# Altium project IPC17学习板.PrjPcb
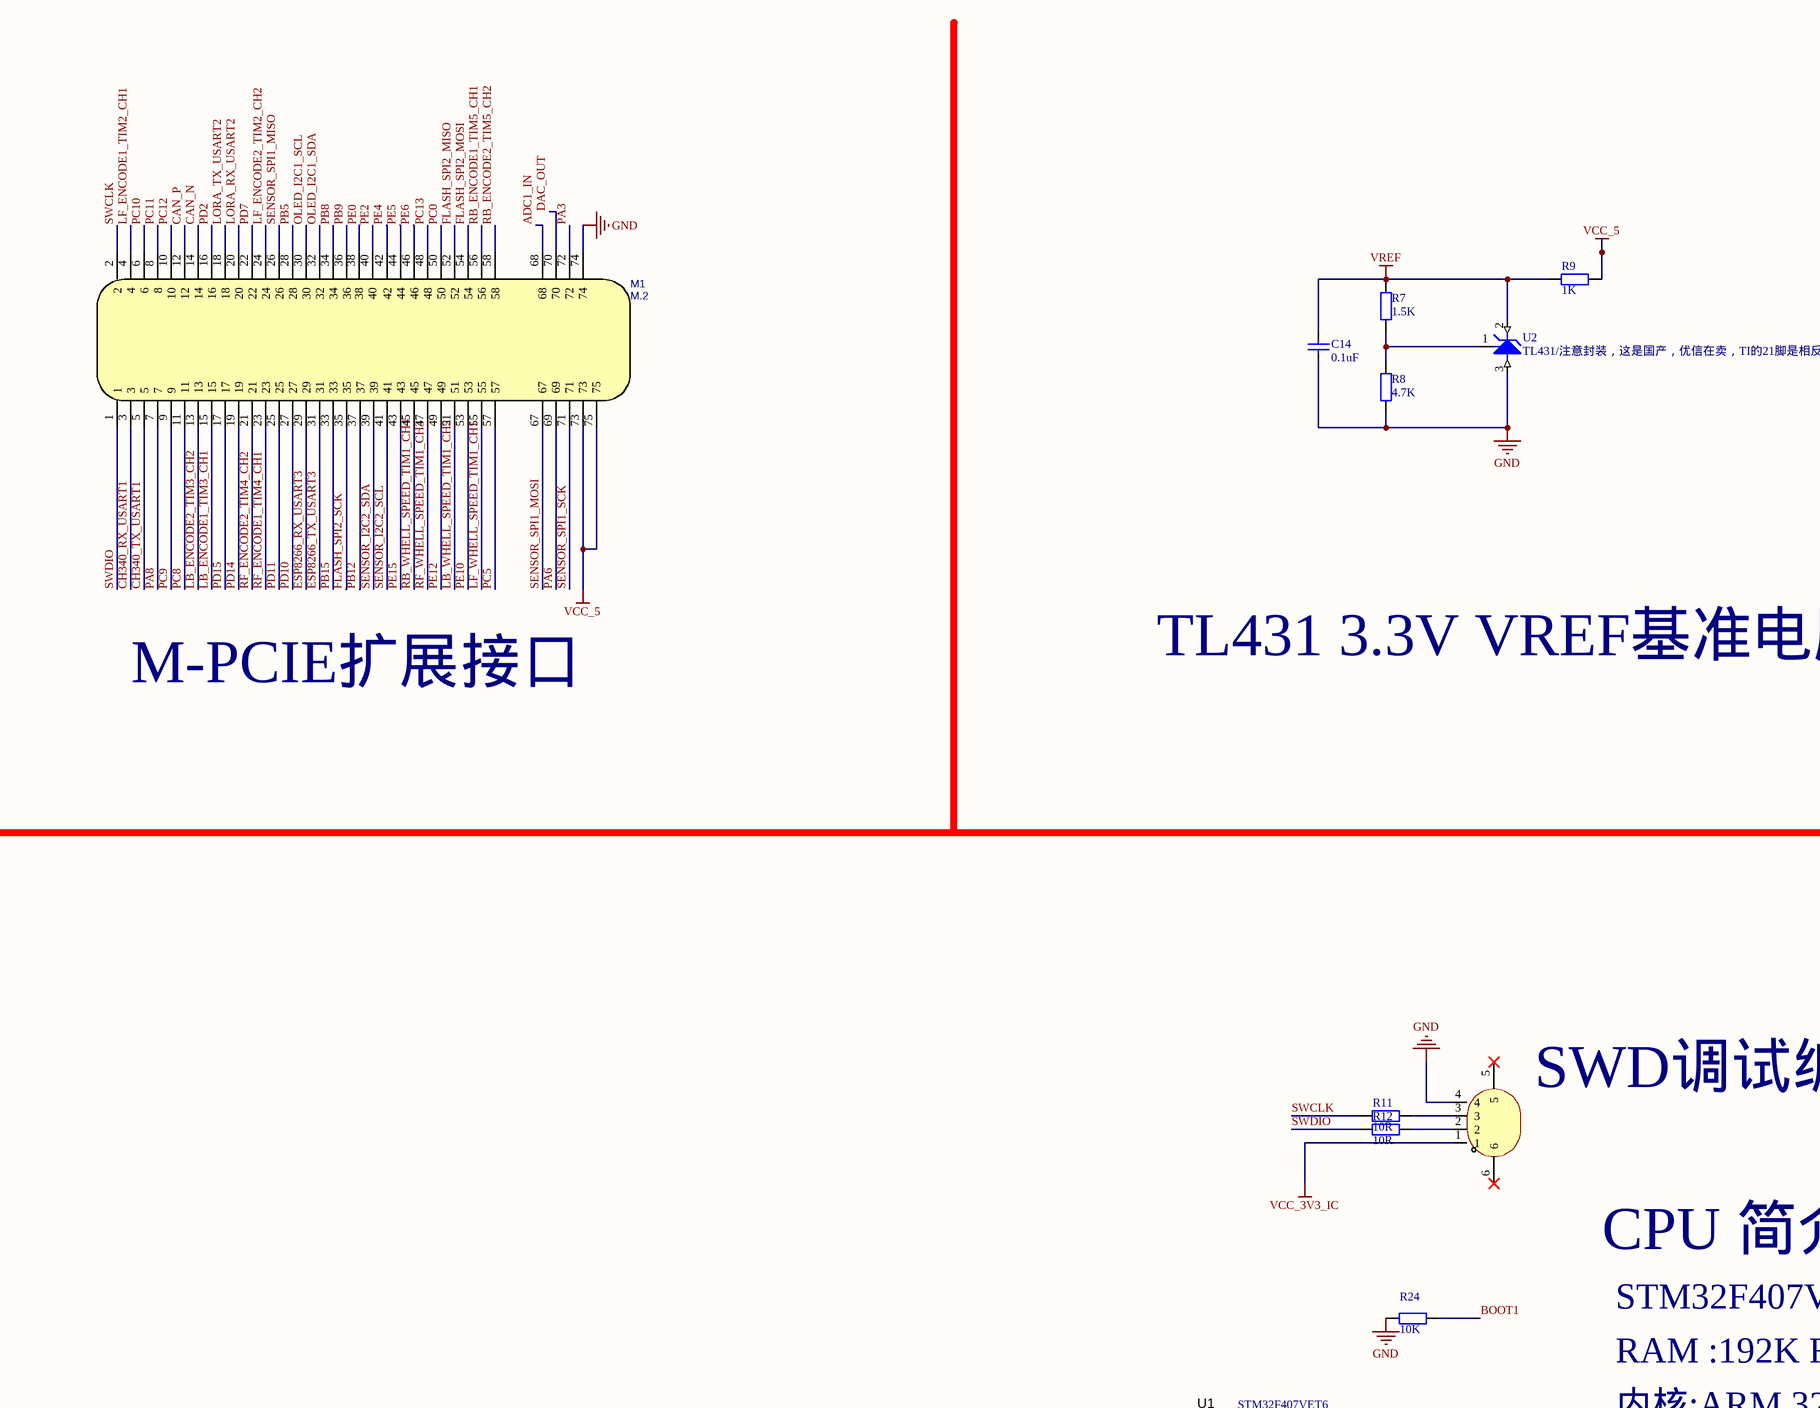
[diagram p0: 主控及低压电源.SchDoc, top left]
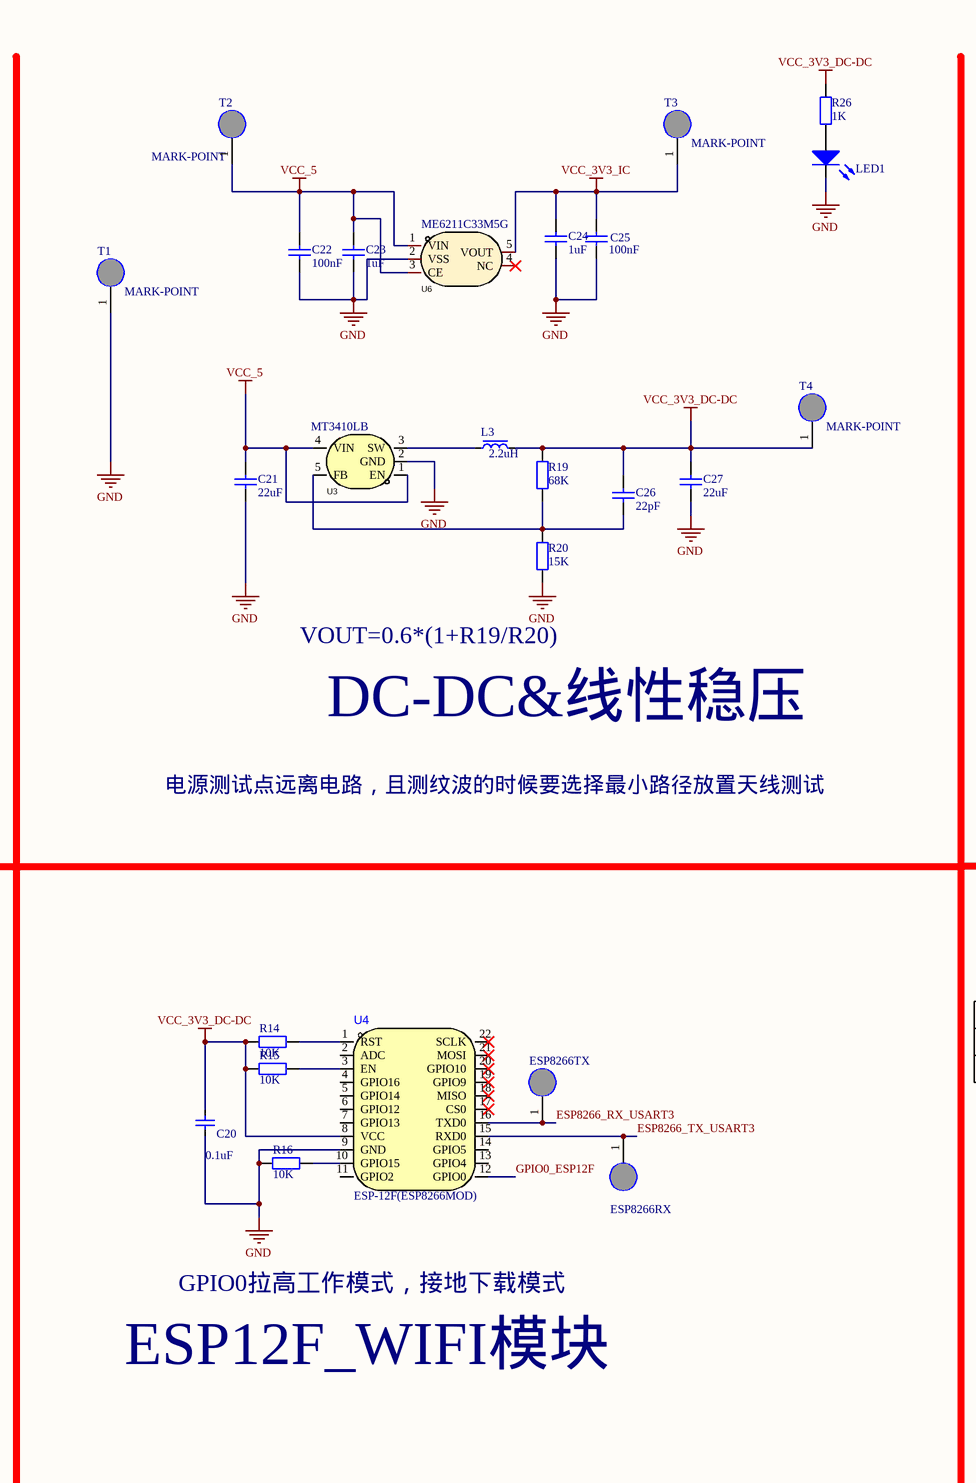
[diagram p1: 主控及低压电源.SchDoc, top middle]
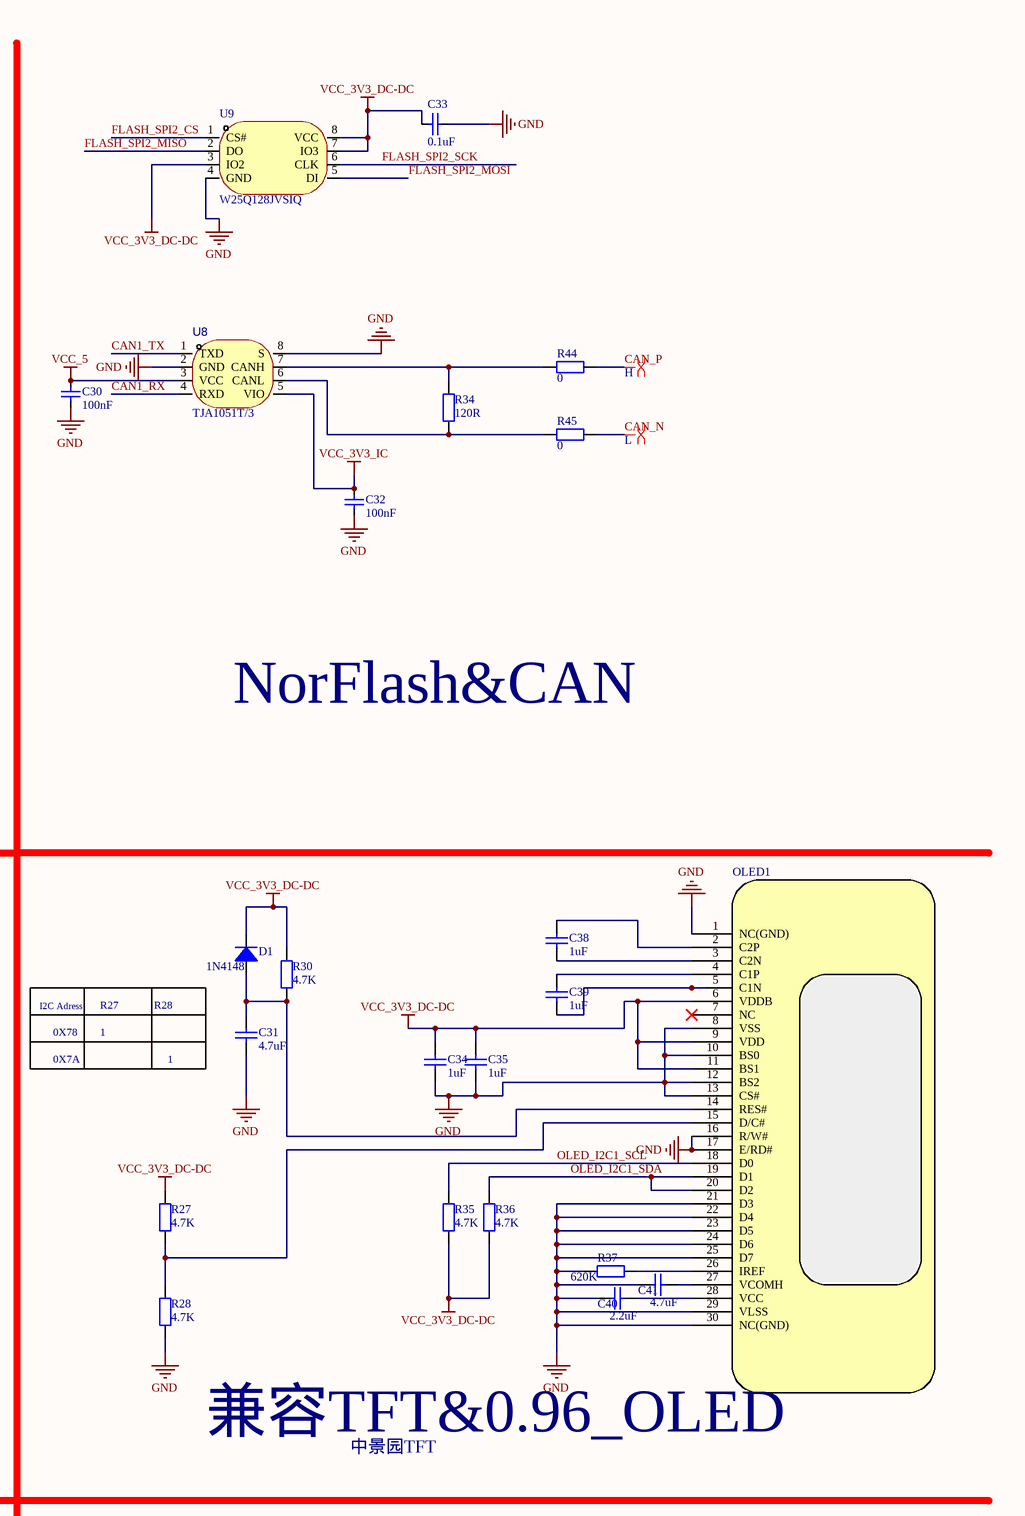
[diagram p2: 主控及低压电源.SchDoc, top right]
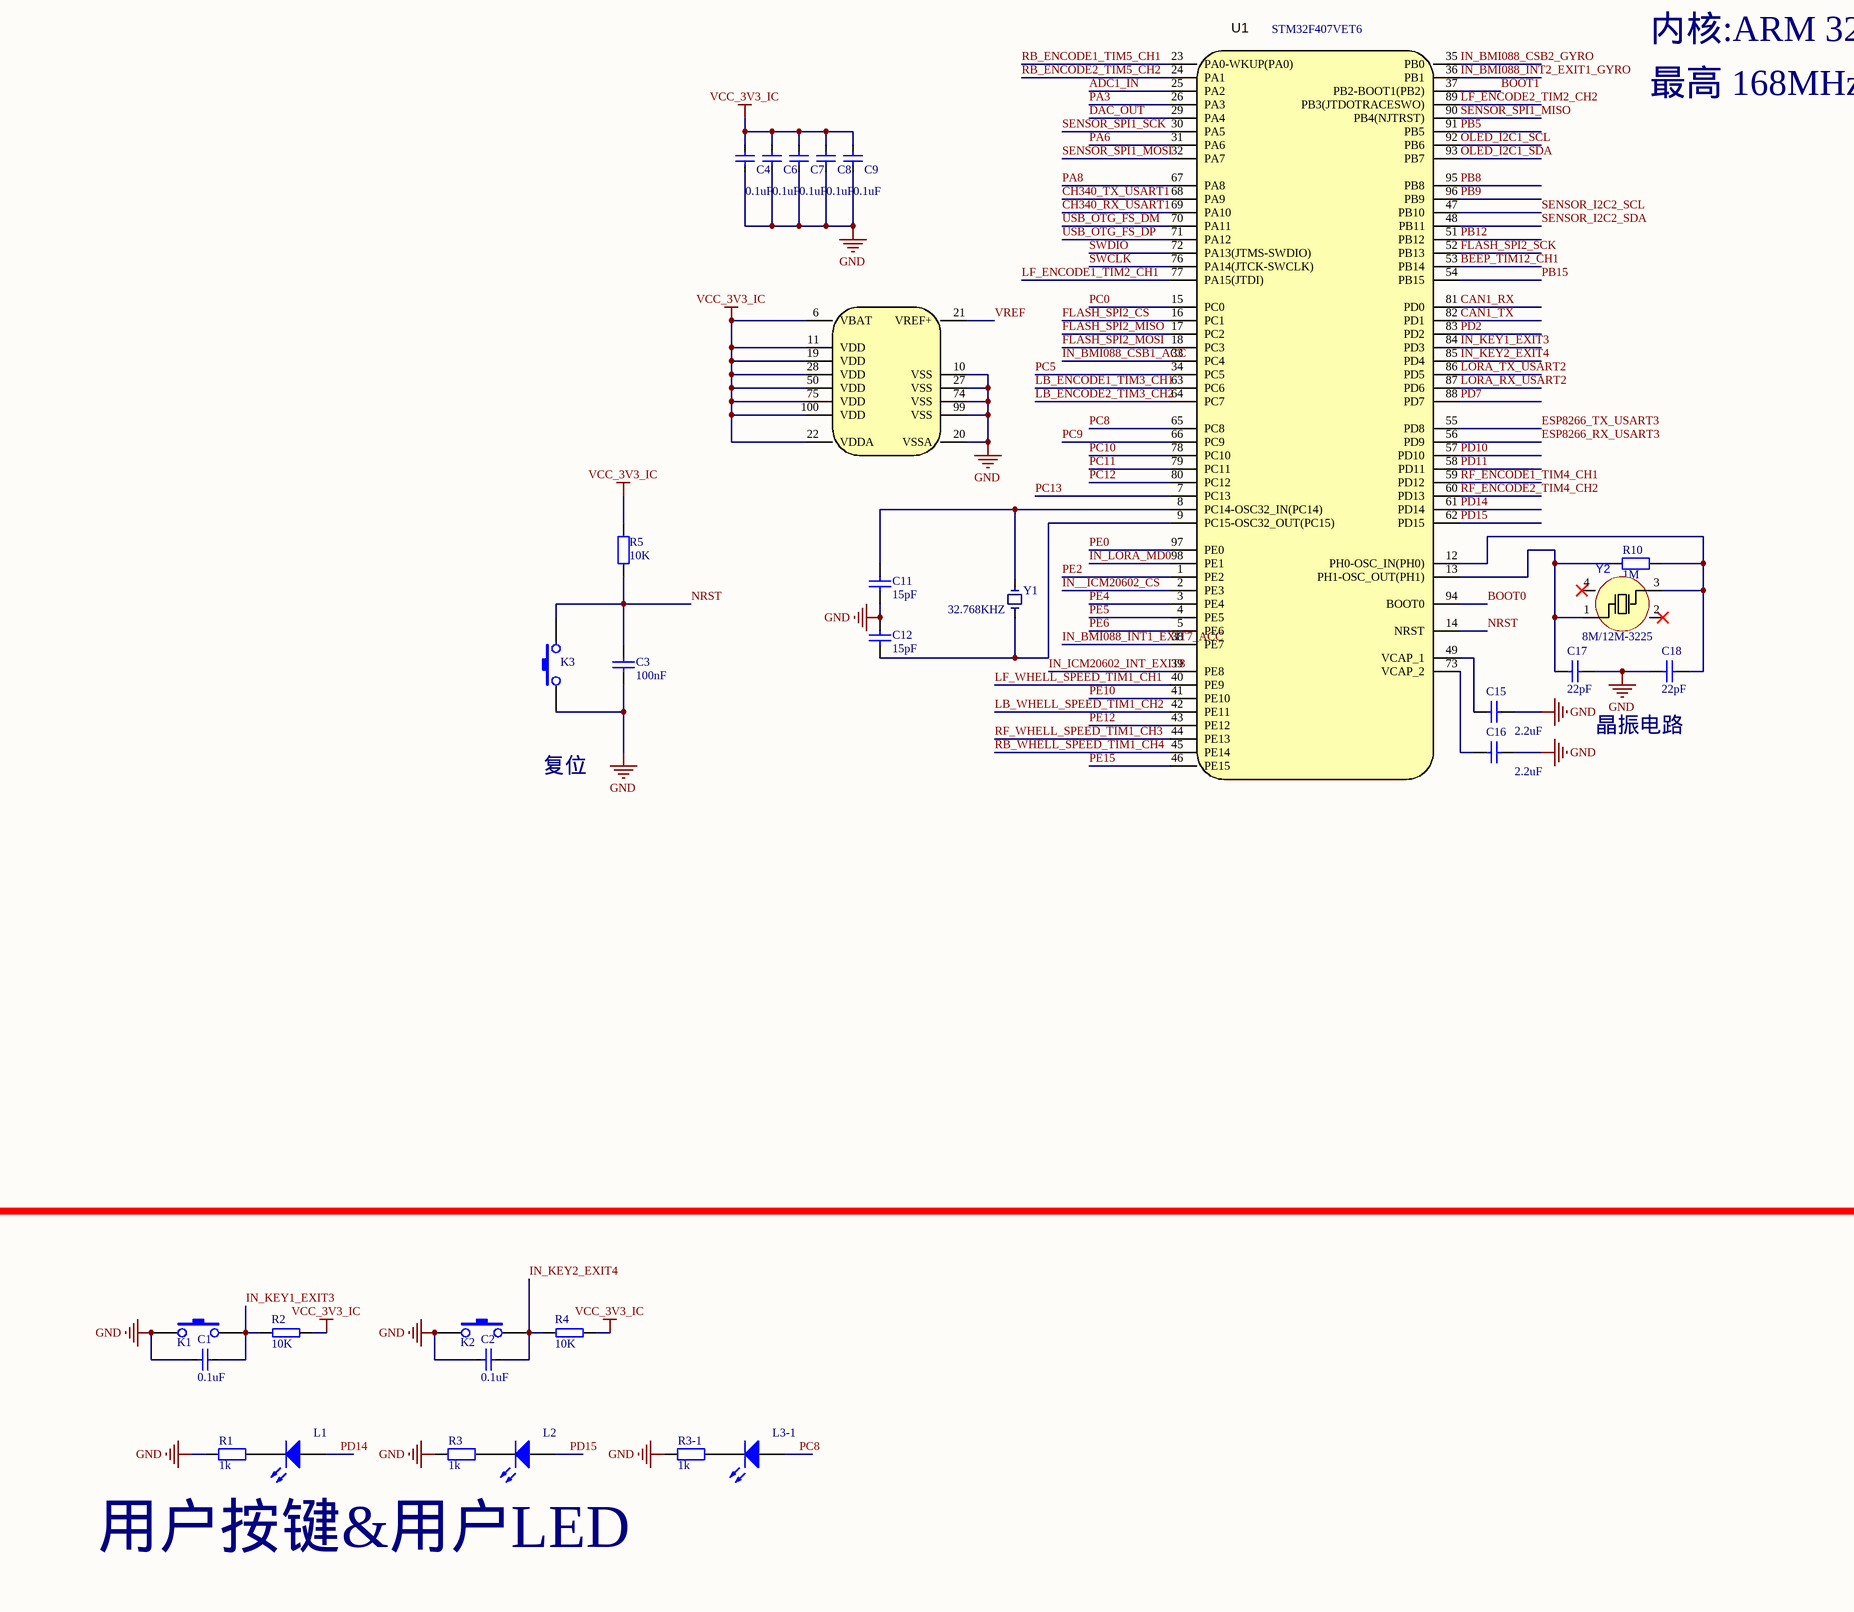
[diagram p3: 主控及低压电源.SchDoc, bottom left]
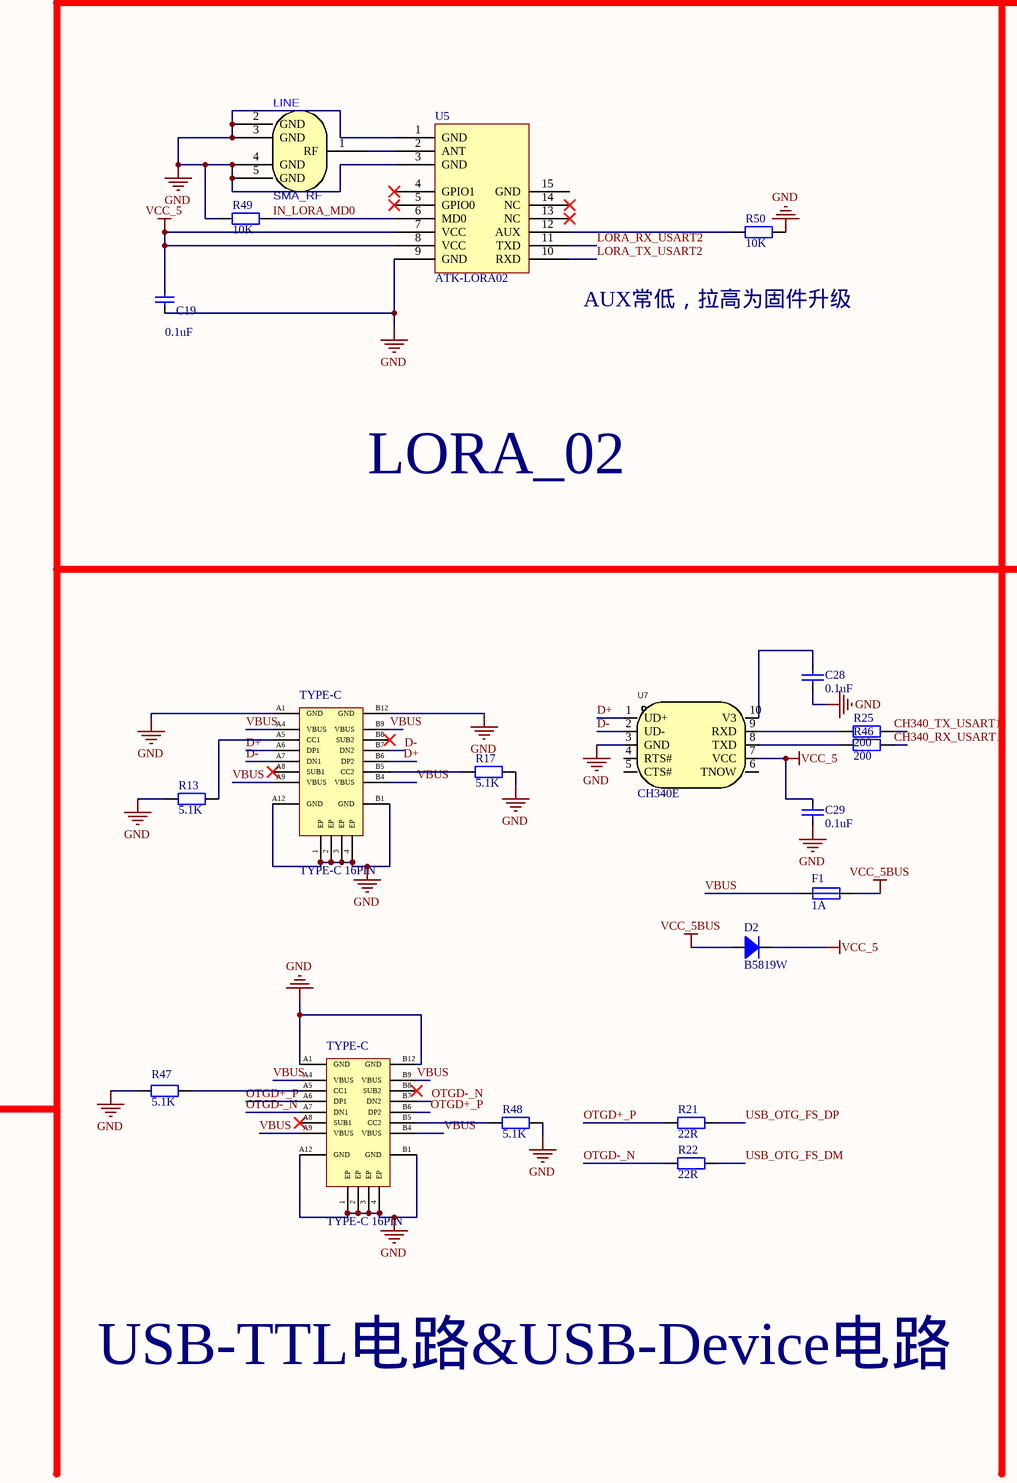
[diagram p4: 主控及低压电源.SchDoc, bottom middle]
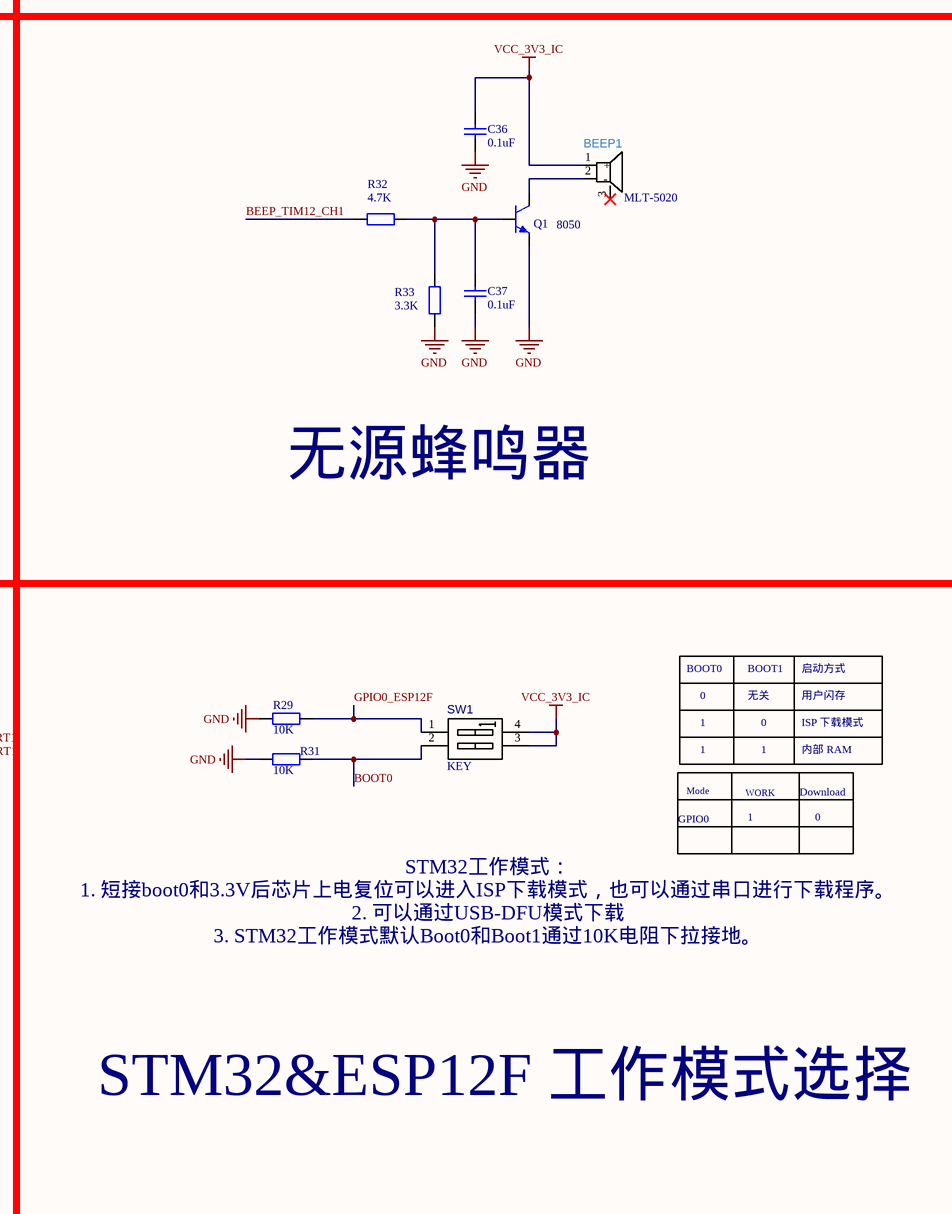
[diagram p5: 主控及低压电源.SchDoc, bottom right]
2 sheets, 142 parts. Net scope: global (net labels, ports and power ports of the same name join across sheets).
Board files: 两层.PcbDoc, 四层板(完成).PcbDoc
Sheets:
  主控及低压电源.SchDoc
  传感器,通信模块电路.SchDoc

## Sheet 主控及低压电源.SchDoc
size A1

### Parts
1  TYPE-C 16PIN  [TYPE-C 16PIN]
2  TYPE-C 16PIN  [TYPE-C 16PIN]
BEEP1  MLT-5020  [BUZ-SMD_L5.0-W5.5-P4.60]
C1  0.1uF  [0805_C]
C2  0.1uF  [0805_C]
C3  100nF  [0603_C]
C4  0.1uF  [0603_C]
C6  0.1uF  [0603_C]
C7  0.1uF  [0603_C]
C8  0.1uF  [0603_C]
C9  0.1uF  [0603_C]
C11  15pF  [0603_C]
C12  15pF  [0603_C]
C14  0.1uF  [0603_C]
C15  2.2uF  [0603_C]
C16  2.2uF  [0603_C]
C17  22pF  [0603_C]
C18  22pF  [0603_C]
C19  0.1uF  [0603_C]
C20  0.1uF  [0603_C]
C21  22uF  [0603_C]
C22  100nF  [0805C]
C23  1uF  [0805_C]
C24  1uF  [0805_C]
C25  100nF  [0805C]
C26  22pF  [0603_C]
C27  22uF  [1206_C]
C28  0.1uF  [0603_C]
C29  0.1uF  [0603_C]
C30  100nF  [0603_C]
C31  4.7uF  [0603_C]
C32  100nF  [0603_C]
C33  0.1uF  [0603_C]
C34  1uF  [0603_C]
C35  1uF  [0603_C]
C36  0.1uF  [0603_C]
C37  0.1uF  [0603_C]
C38  1uF  [0603_C]
C39  1uF  [0603_C]
C40  2.2uF  [0603_C]
C41  4.7uF  [0603_C]
D1  1N4148  [SOD123]
D2  B5819W  [SOD123]
ESP8266RX  MARK-POINT  [MARK-POINT]  (value not drawn)
ESP8266TX  MARK-POINT  [MARK-POINT]  (value not drawn)
F1  value 1A  [FUSE_1206]  (hidden comment: Fuse 1)
J1  XH-4P卧贴  [CONN-SMD_2.54-4P-WT]  (value not drawn)
K1  SW-PB  [key-sop]  (value not drawn)
K2  SW-PB  [key-sop]  (value not drawn)
K3  SW-PB  [key-sop]  (value not drawn)
L1  LED0  [0603_LED]  (value not drawn)
L2  LED0  [0603_LED]  (value not drawn)
L3  2.2uH  [SMD]
L3-1  LED0  [0603_LED]  (value not drawn)
LED1  LED_0603_BLUE  [0603_LED]  (value not drawn)
LINE  SMA_RF  [SMA_RF偏脚]
M1  M.2  [M.2 M]
OLED1  OLED_0.96_30P  [oled_0.96_30p]  (value not drawn)
Q1  8050  [SOT_23]
R1  1K  [0603_R]
R2  10K  [0603_R]
R3  1K  [0603_R]
R3-1  1K  [0603_R]
R4  10K  [0603_R]
R5  10K  [0603_R]
R7  1.5K  [0603_R]
R8  4.7K  [0603_R]
R9  1K  [0603_R]
R10  1M  [0603_R]
R11  10R  [0603_R]
R12  10R  [0603_R]
R13  5.1K  [0603_R]
R14  10K  [0603_R]
R15  10K  [0603_R]
R16  10K  [0603_R]
R17  5.1K  [0603_R]
R19  68K  [0603_R]
R20  15K  [0603_R]
R21  22R  [0603_R]
R22  22R  [0603_R]
R24  10K  [0603_R]
R25  value 200  [0603_R]  (hidden comment: 200R)
R26  1K  [0603_R]
R27  4.7K  [0603_R]
R28  4.7K  [0603_R]
R29  10K  [0603_R]
R30  4.7K  [0603_R]
R31  10K  [0603_R]
R32  4.7K  [0603_R]
R33  3.3K  [0603_R]
R34  120R  [0603_R]
R35  4.7K  [0603_R]
R36  4.7K  [0603_R]
R37  620K  [0603_R]
R44  0  [0603_R]
R45  0  [0603_R]
R46  value 200  [0603_R]  (hidden comment: 200R)
R47  5.1K  [0603_R]
R48  5.1K  [0603_R]
R49  10K  [0603_R]
R50  10K  [0603_R]
SW1  KEY  [SW-SMD_4P_DSHP02TSGET]
T1  MARK-POINT  [MARK-POINT]
T2  MARK-POINT  [MARK-POINT]
T3  MARK-POINT  [MARK-POINT]
T4  MARK-POINT  [MARK-POINT]
U1  STM32F407VET6  [LQF-100PIN]
U2  TL431/注意封装，这是国产，优信在卖，TI的21脚是相反，一切以432的封装为准  [SOT23-3 `]
U3  MT3410LB  [SOT23-5]
U4  ESP-12F(ESP8266MOD)  [WIFIM-SMD_ESP-12F-ESP8266MOD]
U5  ATK-LORA02  [ATK-LORA02]
U6  ME6211C33M5G  [SOT23-5]
U7  CH340E  [MSOP-10_L3.0-W3.0-P0.50-LS5.0-BL]
U8  TJA1051T/3  [SOP-8]
U9  W25Q128JVSIQ  [SOIC-8_L5.3-W5.3-P1.27-LS8.0-BL]
Y1  32.768KHZ  [OSC-SMD_L3.2-W1.5]
Y2  8M/12M-3225  [OSC-SMD_4P-L3.2-W2.5-BL]

### Nets
GND: 1.1(EP) 1.2(EP) 1.3(EP) 1.4(EP) 1.A1(GND) 1.A12(GND) 1.B1(GND) 1.B12(GND) 2.1(EP) 2.2(EP) 2.3(EP) 2.4(EP) 2.A1(GND) 2.A12(GND) 2.B1(GND) 2.B12(GND) C1.1 C2.1 C3.1 C4.2 C6.2 C7.2 C8.2 C9.2 C11.1 C12.1 C14.1 C15.2 C16.2 C17.2 C18.1 C19.2 C20.2 C21.1 C22.1 C23.1 C24.1 C25.1 C27.1 C28.1 C29.1 C30.1 C31.1 C32.1 C33.2 C34.1 C35.1 C36.2 C37.2 C40.2 C41.2 J1.4 K1.1 K2.1 K3.1 LED1.2(K) LINE.2(GND) LINE.3(GND) LINE.4(GND) LINE.5(GND) M1.74 OLED1.1(NC(GND)) OLED1.8(VSS) OLED1.10(BS0) OLED1.12(BS2) OLED1.13(CS#) OLED1.16(R/W#) OLED1.17(E/RD#) OLED1.21(D3) OLED1.22(D4) OLED1.23(D5) OLED1.24(D6) OLED1.25(D7) OLED1.29(VLSS) OLED1.30(NC(GND)) Q1.2(E) R1.1 R3.1 R3-1.1 R8.2 R13.2 R16.1 R17.1 R20.2 R24.2 R28.1 R29.2 R31.2 R33.1 R37.1 R47.2 R48.1 R49.1 R50.2 T1.1 U1.10(VSS) U1.20(VSSA) U1.27(VSS) U1.74(VSS) U1.99(VSS) U2.3(A) U3.2(GND) U4.9(GND) U5.1(GND) U5.3(GND) U5.9(GND) U6.2(VSS) U7.3(GND) U8.2(GND) U8.8(S) U9.4(GND)
VCC_3V3_DC-DC: C20.1 C26.2 C27.2 C33.1 C34.2 C35.2 D1.2(K) L3.2 OLED1.6(VDDB) OLED1.9(VDD) OLED1.11(BS1) R14.1 R15.1 R19.1 R26.2 R27.2 R30.2 R35.1 R36.1 T4.1 U4.8(VCC) U9.3(IO2) U9.7(IO3) U9.8(VCC)
VCC_3V3_IC: BEEP1.1(+) C4.1 C6.1 C7.1 C8.1 C9.1 C24.2 C25.2 C32.2 C36.1 J1.1 R2.2 R4.2 R5.2 SW1.3(B2) SW1.4(B1) T3.1 U1.6(VBAT) U1.11(VDD) U1.19(VDD) U1.22(VDDA) U1.28(VDD) U1.50(VDD) U1.75(VDD) U1.100(VDD) U6.5(VOUT) U8.5(VIO)
VCC_5: C19.1 C21.2 C22.2 C23.2 C29.2 C30.2 D2.2(K) M1.73 M1.75 R9.1 T2.1 U3.1(EN) U3.4(VIN) U5.7(VCC) U5.8(VCC) U6.1(VIN) U6.3(CE) U7.7(VCC) U8.3(VCC)
VCC_5BUS: D2.1(A) F1.2(IN-)
VREF: C14.2 R7.1 R9.2 U1.21(VREF+) U2.2(K)
ADC1_IN: M1.68 U1.25(PA2)
BEEP_TIM12_CH1: R32.1 U1.53(PB14)
BOOT0: R31.1 SW1.2(A2) U1.94(BOOT0)
BOOT1: R24.1 U1.37(PB2-BOOT1(PB2))
CAN1_RX: U1.81(PD0) U8.4(RXD)
CAN1_TX: U1.82(PD1) U8.1(TXD)
CAN_N: M1.14 R45.1
CAN_P: M1.12 R44.1
CH340_RX_USART1: M1.3 R46.1 U1.69(PA10)
CH340_TX_USART1: M1.5 R25.1 U1.68(PA9)
D+: 1.A6(DP1) 1.B6(DP2) U7.1(UD+)
D-: 1.A7(DN1) 1.B7(DN2) U7.2(UD-)
DAC_OUT: M1.70 U1.29(PA4)
ESP8266_RX_USART3: ESP8266TX.1 M1.29 U1.56(PD9) U4.16(TXD0)
ESP8266_TX_USART3: ESP8266RX.1 M1.31 U1.55(PD8) U4.15(RXD0)
FLASH_SPI2_CS: U1.16(PC1) U9.1(CS#)
FLASH_SPI2_MISO: M1.52 U1.17(PC2) U9.2(DO)
FLASH_SPI2_MOSI: M1.54 U1.18(PC3) U9.5(DI)
FLASH_SPI2_SCK: M1.35 U1.52(PB13) U9.6(CLK)
GPIO0_ESP12F: R29.1 SW1.1(A1) U4.12(GPIO0)
IN__ICM20602_CS: U1.2(PE3)
IN_BMI088_CSB1_ACC: U1.33(PC4)
IN_BMI088_CSB2_GYRO: U1.35(PB0)
IN_BMI088_INT1_EXIT7_ACC: U1.38(PE7)
IN_BMI088_INT2_EXIT1_GYRO: U1.36(PB1)
IN_ICM20602_INT_EXIT8: U1.39(PE8)
IN_KEY1_EXIT3: C1.2 K1.2 R2.1 U1.84(PD3)
IN_KEY2_EXIT4: C2.2 K2.2 R4.1 U1.85(PD4)
IN_LORA_MD0: R49.2 U1.98(PE1) U5.6(MD0)
LB_ENCODE1_TIM3_CH1: M1.15 U1.63(PC6)
LB_ENCODE2_TIM3_CH2: M1.13 U1.64(PC7)
LB_WHELL_SPEED_TIM1_CH2: M1.51 U1.42(PE11)
LF_ENCODE1_TIM2_CH1: M1.4 U1.77(PA15(JTDI))
LF_ENCODE2_TIM2_CH2: M1.24 U1.89(PB3(JTDOTRACESWO))
LF_WHELL_SPEED_TIM1_CH1: M1.55 U1.40(PE9)
LORA_RX_USART2: M1.20 U1.87(PD6) U5.11(TXD)
LORA_TX_USART2: M1.18 U1.86(PD5) U5.10(RXD)
NRST: C3.2 K3.2 R5.1 U1.14(NRST)
OLED_I2C1_SCL: M1.30 OLED1.18(D0) R35.2 U1.92(PB6)
OLED_I2C1_SDA: M1.32 OLED1.19(D1) OLED1.20(D2) R36.2 U1.93(PB7)
OTGD+_P: 2.A6(DP1) 2.B6(DP2) R21.2
OTGD-_N: 2.A7(DN1) 2.B7(DN2) R22.2
PA3: M1.72 U1.26(PA3)
PA6: M1.69 U1.31(PA6)
PA8: M1.7 U1.67(PA8)
PB5: M1.28 U1.91(PB5)
PB8: M1.34 U1.95(PB8)
PB9: M1.36 U1.96(PB9)
PB12: M1.37 U1.51(PB12)
PB15: M1.33 U1.54(PB15)
PC0: M1.50 U1.15(PC0)
PC5: M1.57 U1.34(PC5)
PC8: L3-1.1(A) M1.11 U1.65(PC8)
PC9: M1.9 U1.66(PC9)
PC10: M1.6 U1.78(PC10)
PC11: M1.8 U1.79(PC11)
PC12: M1.10 U1.80(PC12)
PC13: M1.48 U1.7(PC13)
PD2: M1.16 U1.83(PD2)
PD7: M1.22 U1.88(PD7)
PD10: M1.27 U1.57(PD10)
PD11: M1.25 U1.58(PD11)
PD14: L1.1(A) M1.19 U1.61(PD14)
PD15: L2.1(A) M1.17 U1.62(PD15)
PE0: M1.38 U1.97(PE0)
PE2: M1.40 U1.1(PE2)
PE4: M1.42 U1.3(PE4)
PE5: M1.44 U1.4(PE5)
PE6: M1.46 U1.5(PE6)
PE10: M1.53 U1.41(PE10)
PE12: M1.49 U1.43(PE12)
PE15: M1.43 U1.46(PE15)
RB_ENCODE1_TIM5_CH1: M1.56 U1.23(PA0-WKUP(PA0))
RB_ENCODE2_TIM5_CH2: M1.58 U1.24(PA1)
RB_WHELL_SPEED_TIM1_CH4: M1.45 U1.45(PE14)
RF_ENCODE1_TIM4_CH1: M1.23 U1.59(PD12)
RF_ENCODE2_TIM4_CH2: M1.21 U1.60(PD13)
RF_WHELL_SPEED_TIM1_CH3: M1.47 U1.44(PE13)
SENSOR_I2C2_SCL: M1.41 U1.47(PB10)
SENSOR_I2C2_SDA: M1.39 U1.48(PB11)
SENSOR_SPI1_MISO: M1.26 U1.90(PB4(NJTRST))
SENSOR_SPI1_MOSI: M1.67 U1.32(PA7)
SENSOR_SPI1_SCK: M1.71 U1.30(PA5)
SWCLK: M1.2 R11.1 U1.76(PA14(JTCK-SWCLK))
SWDIO: M1.1 R12.1 U1.72(PA13(JTMS-SWDIO))
USB_OTG_FS_DM: R22.1 U1.70(PA11)
USB_OTG_FS_DP: R21.1 U1.71(PA12)
VBUS: 1.A4(VBUS) 1.A9(VBUS) 1.B4(VBUS) 1.B9(VBUS) 2.A4(VBUS) 2.A9(VBUS) 2.B4(VBUS) 2.B9(VBUS) F1.1(IN+)
Net1_A5: 1.A5(CC1) R13.1
Net1_B5: 1.B5(CC2) R17.2
Net2_A5: 2.A5(CC1) R47.1
Net2_B5: 2.B5(CC2) R48.2
NetBEEP1_2: BEEP1.2(-) Q1.3(C)
NetC11_2: C11.2 U1.8(PC14-OSC32_IN(PC14)) Y1.1
NetC12_2: C12.2 U1.9(PC15-OSC32_OUT(PC15)) Y1.2
NetC15_1: C15.1 U1.49(VCAP_1)
NetC16_1: C16.1 U1.73(VCAP_2)
NetC17_1: C17.1 R10.2 U1.13(PH1-OSC_OUT(PH1)) Y2.1(OSC1)
NetC18_2: C18.2 R10.1 U1.12(PH0-OSC_IN(PH0)) Y2.3(OSC2)
NetC26_1: C26.1 R19.2 R20.1 U3.5(FB)
NetC28_2: C28.2 U7.10(V3)
NetC31_2: C31.2 D1.1(A) OLED1.14(RES#) R30.1
NetC37_1: C37.1 Q1.1(B) R32.2 R33.2
NetC38_1: C38.1 OLED1.3(C2N)
NetC38_2: C38.2 OLED1.2(C2P)
NetC39_1: C39.1 OLED1.5(C1N)
NetC39_2: C39.2 OLED1.4(C1P)
NetC40_1: C40.1 OLED1.28(VCC)
NetC41_1: C41.1 OLED1.27(VCOMH)
NetJ1_2: J1.2 R12.2
NetJ1_3: J1.3 R11.2
NetL1_2: L1.2(K) R1.2
NetL2_2: L2.2(K) R3.2
NetL3-1_2: L3-1.2(K) R3-1.2
NetL3_1: L3.1 U3.3(SW)
NetLED1_1: LED1.1(A) R26.1
NetLINE_1: LINE.1(RF) U5.2(ANT)
NetOLED1_15: OLED1.15(D/C#) R27.1 R28.2
NetOLED1_26: OLED1.26(IREF) R37.2
NetR7_2: R7.2 R8.1 U2.1(R)
NetR14_2: R14.2 U4.1(RST)
NetR15_2: R15.2 U4.3(EN)
NetR16_2: R16.2 U4.10(GPIO15)
NetR25_2: R25.2 U7.9(RXD)
NetR34_1: R34.1 R44.2 U8.7(CANH)
NetR34_2: R34.2 R45.2 U8.6(CANL)
NetR46_2: R46.2 U7.8(TXD)
NetR50_1: R50.1 U5.12(AUX)

Not connected (* = marked no-connect by the designer): 1 A8(SUB1)* B8(SUB2)*; 2 A8(SUB1)* B8(SUB2)*; BEEP1 3(NC)*; J1 5* 6*; OLED1 7(NC)*; U4 2(ADC) 4(GPIO16) 5(GPIO14) 6(GPIO12) 7(GPIO13) 11(GPIO2) 13(GPIO4) 14(GPIO5) 17(CS0)* 18(MISO)* 19(GPIO9)* 20(GPIO10)* 21(MOSI)* 22(SCLK)*; U5 4(GPIO1)* 5(GPIO0)* 13(NC)* 14(NC)* 15(GND); U6 4(NC)*; U7 4(RTS#) 5(CTS#) 6(TNOW); Y2 2(GND)* 4(GND)*

### Layout directives
differential pair: CAN_N, CAN_P

### Notes on the sheet
- (near R44) H
- (near R45) L
- VOUT=0.6*(1+R19/R20)
- M-PCIE扩展接口
- TL431 3.3V VREF基准电压
- DC-DC&线性稳压
- NorFlash&CAN
- 电源测试点远离电路，且测纹波的时候要选择最小路径放置天线测试
- I2C Adress
- R27
- R28
- 0X78
- 0X7A
- 1
- (near J1) SWD调试编程接口
- CPU 简介
- GPIO0拉高工作模式，接地下载模式
- STM32F407VET6
- RAM :192K FLASH :12K
- ESP12F_WIFI模块
- 内核:ARM 32位的Cortex-M4 CPU
- 兼容TFT&0.96_OLED
- 中景园TFT
- 最高 168MHz 工作频率
- AUX常低，拉高为固件升级
- LORA_02
- 无源蜂鸣器
- 晶振电路
- BOOT0
- BOOT1
- 启动方式
- 复位
- 0
- 无关
- 用户闪存
- ISP 下载模式
- Mode
- WORK
- Download
- 内部 RAM
- GPIO0
- STM32工作模式：
  1. 短接boot0和3.3V后芯片上电复位可以进入ISP下载模式，也可以通过串口进行下载程序。
  2. 可以通过USB-DFU模式下载
  3. STM32工作模式默认Boot0和Boot1通过10K电阻下拉接地。
- STM32&ESP12F 工作模式选择
- USB-TTL电路&USB-Device电路
- 用户按键&用户LED
- (in symbol OLED_0.96_30P) 128 x 64
- (in symbol TYPE-C 16PIN) TYPE-C

### Library data of the parts
BEEP1 = MLT-5020: Manufacturer: 华能; Name: 4000Hz; Add into BOM: yes; Oscillator Circuit: 无源(外部驱动); Technology Type: 电磁式; Value: 4000Hz; Symbol: MLT-5020; Device: MLT-5020; LCSC Part Name: MLT-5020; Supplier Part: C94598; Manufacturer Part: MLT-5020; Supplier Footprint: SMD,5x5mm; JLCPCB Part Class: Extended Part; Datasheet: https://atta.szlcsc.com/upload/public/pdf/source/20210811/111454390007D221D7259018FB170E62.pdf; Supplier: LCSC; Convert to PCB: yes; Length: 5.2mm; Width: 5.2mm; Height: 2.5mm
C1 C2 C33 = Cap_0603: Capacitor; Value: 0.1uF
C3 C11 C12 C15-C18 C21-C27 C31 C34-C41 = CAP: Capacitor; Value: 20pF
C4 C6-C9 C19 C20 C30 C32 = CAP1
C14 C28 C29 = Cap_0805: Capacitor; Value: 0.1uF
D1 D2 = 1N4007
F1 = Fuse 1: FUSE,Littelfuse
J1 = XH-4P卧贴: Manufacturer: BOOMELE(博穆精密); Symbol: 2.54-4P; Add into BOM: yes; Reference Series: XH; Pitch: 2.54mm; Pins Structure: 1x4P; Number of PINs Per Row: 4; Name: XH-4P卧贴; Device: XH-4P卧贴; LCSC Part Name: XH 2.54mm 1x4P 卧贴; Supplier Part: C146120; Manufacturer Part: XH-4P卧贴; Supplier Footprint: SMD,P=2.54mm; JLCPCB Part Class: Extended Part; Datasheet: https://atta.szlcsc.com/upload/public/pdf/source/20220908/79989BAB89CEC7224389904CB8712A50.pdf; Supplier: LCSC; Convert to PCB: yes; Number of Rows: 1; Row Spacing: -; Gender: -; Mounting Style: -; Current Rating (Max): -; Contact Material: -; Contact Plating: -; Operating Temperature Range: -; Welding Temperature (Max): -
L1 L2 L3-1 = LED0: Typical INFRARED GaAs LED; Published: 8-Jun-2000; LatestRevisionDate: 08-Jul-2005; LatestRevisionNote: Mech Layer 1 removed.; PackageReference: LED-0; Publisher: Altium Limited; PackageDescription: LED; 2 Leads
L3 = INDUCTANCE
LED1 = LED_0603_BLUE: LED
M1 = M.2: Contributor: LAXXI; spicePre: U; spiceSymbolName: M.2
OLED1 = OLED_0.96_30P: Manufacturer: WiseChip; Manufacturer Part: VG-2864KSWEG01; Pin Type: IN; Add into BOM: yes; Symbol: OLED_0.96_30P; Device: OLED_0.96_30P; Supplier: LCSC; Supplier Part: C194313; JLCPCB Part Class: 扩展库; Convert to PCB: yes
Q1 = S8050: NPN; pin to pad: 1>2 2>1; Value: S8050
R1 R3 R3-1 = Res2: Resistor; Published: 8-Jun-2000; LatestRevisionDate: 17-Jul-2002; LatestRevisionNote: Re-released for DXP Platform.; PackageReference: AXIAL-0.4; Publisher: Altium Limited; PackageDescription: Axial Device, Thru-Hole; 2 Leads; 0.4 in Pin Spacing; Value: 1k
R2 R4 = RES_10K
R5 R7 R8 R14-R16 R19 R20 R27 R28 R30 R34-R37 R49 R50 = RES: Ressitor; Value: 1K
R9 R26 = RES: Ressitor; Value: 1K
R10-R13 R17 R21 R22 R24 R25 R29 R31-R33 R44-R48 = Res_0603: Resistor
  R10: Value: 1M
  R11 R12: Value: 10R
  R13 R17 R47 R48: Value: 5.1K
  R21 R22: Value: 22R
  R24 R29 R31: Value: 10K
  R32: Value: 4.7K
  R33: Value: 3.3K
  R44 R45: Value: 0
SW1 = DSHP02TSGET: Manufacturer: YE; Add into BOM: yes; Circuit: 单刀单掷; Number of Positions: 2; Name: DSHP02TSGET; Symbol: DSHP02TSGET; Device: DSHP02TSGET; LCSC Part Name: 2位 1.27间距; Supplier Part: C40735; Manufacturer Part: DSHP02TSGET; Supplier Footprint: SMD-4P,4.1x5.4mm; JLCPCB Part Class: Extended Part; Datasheet: https://atta.szlcsc.com/upload/public/pdf/source/20150928/1457707425261.pdf; Supplier: LCSC; Convert to PCB: yes; Type: 平拨，凹槽式; Lead Pitch: 1.27mm; Color: 黑色
U1 = STM32F407VET6: Manufacturer: ST(意法半导体); Add into BOM: yes; CPU Core: ARM Cortex-M4; Maximum Frequency: 168MHz; Supply Voltage Range: 1.8V~3.6V; Internal Oscillator: 有; Program FLASH Size: 512K@x8bit; RAM Size: 192KB; GPIO Ports Number: 82; ADC (Units/Channels/bits): 1@x16ch/12bit; DAC (Units/Channels/bits): 1@x2ch/12bit; Peripherals / Functions / Protocol Stacks: 欠压检测/复位；DMA；LCD驱动；看门狗；POR；PWM; Name: STM32F407VET6; Symbol: STM32F407VET6; Device: STM32F407VET6; LCSC Part Name: ARM Cortex-M4 168MHz 闪存：512K@x8bit RAM：192KB; Supplier Part: C28730; Manufacturer Part: STM32F407VET6; Supplier Footprint: LQFP-100(14x14); JLCPCB Part Class: Extended Part; Datasheet: https://atta.szlcsc.com/upload/public/pdf/source/20140322/1457707027869.pdf; Supplier: LCSC; Convert to PCB: yes; EEPROM/Data FLASH Size: -; Operating Temperature Range: -40℃~+85℃
U2 = TL431: IC
U3 = MT3410LB: Manufacturer: 西安航天民芯; Add into BOM: yes; Name: MT3410LB; Symbol: MT3410LB; Device: MT3410LB; LCSC Part Name: MT3410LB; Supplier Part: C883494; Manufacturer Part: MT3410LB; Supplier Footprint: SOT-23-5; JLCPCB Part Class: Extended Part; Datasheet: https://atta.szlcsc.com/upload/public/pdf/source/20201021/C883494_10DFCA7CC096175FD05A8C016AA3F473.pdf; Supplier: LCSC; Convert to PCB: yes
U4 = ESP-12F(ESP8266MOD): Manufacturer: Ai-Thinker(安信可); Name: 2.4GHz; Add into BOM: yes; Value: 2.4GHz; Output Power: 16dBm; Support Interface: GPIO；UART；I2C；PWM；SPI；ADC; Antenna Type: PCB 板载天线; Wireless Standard: 802.11b/g/n; Operating Voltage: 3.3V; Receive  Current: 120mA; Send  Current: 170mA; Sensitivity: -90dBm; Symbol: ESP-12F(ESP8266MOD); Device: ESP-12F(ESP8266MOD); LCSC Part Name: 完整的802.11b/g/n Wi-Fi的SoC模块; Supplier Part: C82891; Manufacturer Part: ESP-12F(ESP8266MOD); Supplier Footprint: SMD,16x24mm; JLCPCB Part Class: Extended Part; Datasheet: https://atta.szlcsc.com/upload/public/pdf/source/20210219/C82891_ABD84A460F4F056A2757267CCCA4B508.pdf; Supplier: LCSC; Convert to PCB: yes; Core Processor: ESP8266; Operating Temperature: -40℃~+85℃
U5 = LORA02
U6 = ME6211C25M5G: Manufacturer: MICRONE(南京微盟); Add into BOM: yes; Name: ME6211C25M5G; Symbol: ME6211C25M5G; Device: ME6211C25M5G; LCSC Part Name: ME6211C25M5G; Supplier Part: C2835813; Manufacturer Part: ME6211C25M5G; Supplier Footprint: SOT23-5; JLCPCB Part Class: Extended Part; Datasheet: https://atta.szlcsc.com/upload/public/pdf/source/20211210/ACC7C3E9BA56F250BF966425916E32B9.pdf; Supplier: LCSC; Convert to PCB: yes
U7 = CH340E: Manufacturer: WCH(南京沁恒); Add into BOM: yes; Applications Function: 收发器; Protocol: USB 2.0; Data Rate: 2Mbps; Supply Voltage: 3.3V；5V; Name: CH340E; Symbol: CH340E; Device: CH340E; LCSC Part Name: USB转串口芯片 CH340; Supplier Part: C99652; Manufacturer Part: CH340E; Supplier Footprint: MSOP-10; JLCPCB Part Class: Extended Part; Datasheet: https://atta.szlcsc.com/upload/public/pdf/source/20200819/C99652_97FFC0DF2539BFF05CD752AD9221D632.pdf; Supplier: LCSC; Convert to PCB: yes
U8 = TJA1051T/3: Manufacturer: Tokmas(托克马斯); Add into BOM: yes; Name: TJA1051T/3; Symbol: TJA1051T/3; Device: TJA1051T/3; LCSC Part Name: CAN芯片; Supplier Part: C5342108; Manufacturer Part: TJA1051T/3; Supplier Footprint: SOP-8; JLCPCB Part Class: Extended Part; Datasheet: https://atta.szlcsc.com/upload/public/pdf/source/20221230/A2F88B671123D34174A4F40D8F54A86B.pdf; Supplier: LCSC; Convert to PCB: yes
U9 = W25Q128JVSIQ: 128Mbit(16MBx8bit),高速版,; Manufacturer: WINBOND(华邦); Symbol: W25Q128JVSIQTR; Add into BOM: yes; Device: W25Q128JVSIQ; LCSC Part Name: W25Q128JVSIQ; Supplier Part: C97521; Manufacturer Part: W25Q128JVSIQ; Supplier Footprint: SOIC-8-208mil; JLCPCB Part Class: 基础库; Datasheet: https://atta.szlcsc.com/upload/public/pdf/source/20170316/1489627409956.pdf; Supplier: LCSC; Convert to PCB: yes; Name: W25Q128JVSIQ
Y1 = 晶振: YST310S
Y2 = X322512MSB4SI: 无源晶振; Manufacturer: YXC扬兴科技; Name: 12MHz; Add into BOM: yes; Crystal Type: 贴片无源晶振; Value: 12MHz; Frequency Tolerance: ±10ppm; Frequency Stability: ±30ppm; Load Capacitance: 20pF; Symbol: X322512MSB4SI; Device: X322512MSB4SI; LCSC Part Name: 12MHz ±10ppm 20pF; Supplier Part: C9002; Manufacturer Part: X322512MSB4SI; Supplier Footprint: SMD3225-4P; JLCPCB Part Class: Basic Part; Datasheet: https://atta.szlcsc.com/upload/public/pdf/source/20210329/C112971_1F611BDC486E193C1706F6D8EB5AA189.pdf; Supplier: LCSC; Convert to PCB: yes; Operating Temperature: -40℃~+85℃

## Sheet 传感器,通信模块电路.SchDoc
size A4
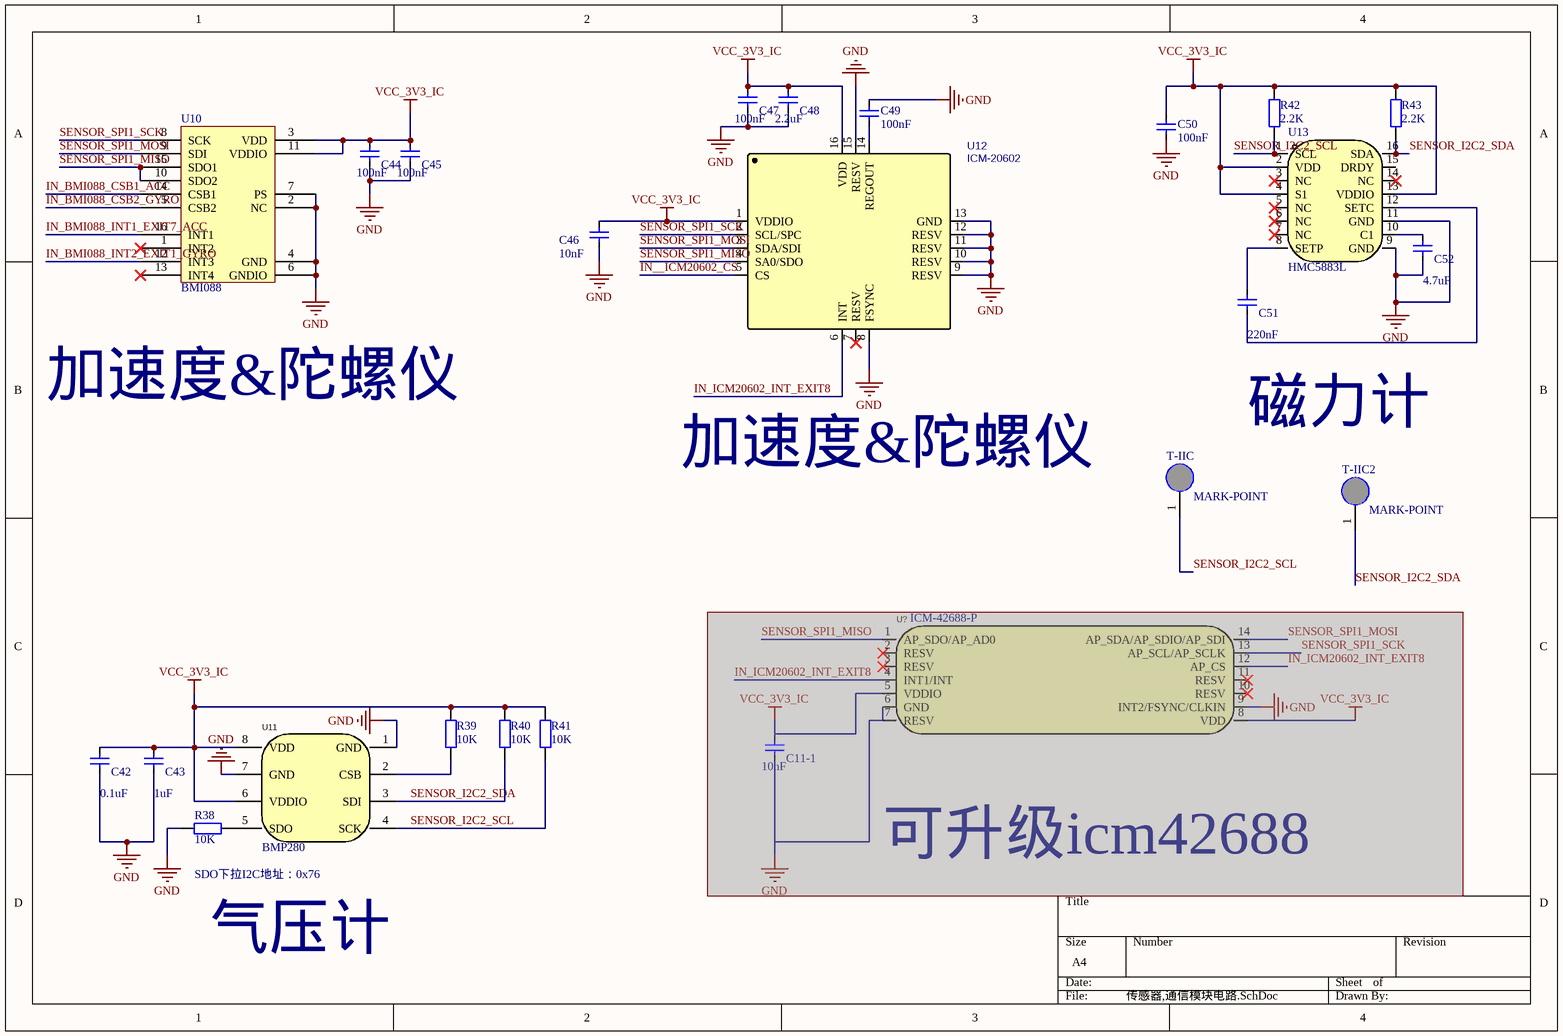
[diagram p6: 传感器,通信模块电路.SchDoc]

### Parts
C11-1  10nF  [0603_C]  (masked out: inside a compile mask, not in the netlist)
C42  0.1uF  [0603_C]
C43  1uF  [0603_C]
C44  100nF  [0603_C]
C45  100nF  [0603_C]
C46  10nF  [0603_C]
C47  100nF  [0603_C]
C48  2.2uF  [0603_C]
C49  100nF  [0603_C]
C50  100nF  [0603_C]
C51  220nF  [0603_C]
C52  4.7uF  [0603_C]
R38  10K  [0603_R]
R39  10K  [0603_R]
R40  10K  [0603_R]
R41  10K  [0603_R]
R42  2.2K  [0603_R]
R43  2.2K  [0603_R]
T-IIC  MARK-POINT  [MARK-POINT]
T-IIC2  MARK-POINT  [MARK-POINT]
U10  BMI088  [LGA-16_L4.5-W3.0-P0.50-BL]
U11  BMP280  [BMP280]
U12  ICM-20602  [ICM20602]
U13  HMC5883L  [HMC5883L]
U?  ICM-42688-P  [LGA-14_L3.0-W2.5-P0.50-TL]  (masked out: inside a compile mask, not in the netlist)

### Nets
GND: C42.2 C43.2 C44.2 C45.2 C46.2 C47.2 C48.2 C49.2 C50.1 C52.2 R38.1 U10.2(NC) U10.4(GND) U10.6(GNDIO) U10.7(PS) U11.1(GND) U11.7(GND) U12.8(FSYNC) U12.9(RESV) U12.10(RESV) U12.11(RESV) U12.12(RESV) U12.13(GND) U12.15(RESV) U13.9(GND) U13.11(GND)
VCC_3V3_IC: C42.1 C43.1 C44.1 C45.1 C46.1 C47.1 C48.1 C50.2 R39.1 R40.1 R41.1 R42.1 R43.1 U10.3(VDD) U10.11(VDDIO) U11.6(VDDIO) U11.8(VDD) U12.1(VDDIO) U12.16(VDD) U13.2(VDD) U13.4(S1) U13.13(VDDIO)
IN__ICM20602_CS: U12.5(CS)
IN_BMI088_CSB1_ACC: U10.14(CSB1)
IN_BMI088_CSB2_GYRO: U10.5(CSB2)
IN_BMI088_INT1_EXIT7_ACC: U10.16(INT1)
IN_BMI088_INT2_EXIT1_GYRO: U10.12(INT3)
IN_ICM20602_INT_EXIT8: U12.6(INT)
SENSOR_I2C2_SCL: R41.2 R42.2 T-IIC.1 U11.4(SCK) U13.1(SCL)
SENSOR_I2C2_SDA: R40.2 R43.2 T-IIC2.1 U11.3(SDI) U13.16(SDA)
SENSOR_SPI1_MISO: U10.10(SDO2) U10.15(SDO1) U12.4(SA0/SDO)
SENSOR_SPI1_MOSI: U10.9(SDI) U12.3(SDA/SDI)
SENSOR_SPI1_SCK: U10.8(SCK) U12.2(SCL/SPC)
NetC49_1: C49.1 U12.14(REGOUT)
NetC51_1: C51.1 U13.8(SETP)
NetC51_2: C51.2 U13.12(SETC)
NetC52_1: C52.1 U13.10(C1)
NetR38_2: R38.2 U11.5(SDO)
NetR39_2: R39.2 U11.2(CSB)

Not connected (* = marked no-connect by the designer): U10 1(INT2)* 13(INT4)*; U12 7(RESV)*; U13 3(NC)* 5(NC)* 6(NC)* 7(NC)* 14(NC)* 15(DRDY)

### Notes on the sheet
- 加速度&陀螺仪
- 磁力计
- SDO下拉I2C地址：0x76
- 可升级icm42688
- 气压计

### Library data of the parts
C11-1 C42-C52 = CAP1
R38-R43 = RES: Ressitor; Value: 1K
U11 = BMP280: Manufacturer: Bosch(博世); Add into BOM: yes; Name: BMP280; Symbol: BMP280; Device: BMP280; LCSC Part Name: BMP280; Supplier Part: C83291; Manufacturer Part: BMP280; Supplier Footprint: LGA-8(2x2.5); JLCPCB Part Class: Extended Part; Datasheet: https://atta.szlcsc.com/upload/public/pdf/source/20200702/C83291_F39E84AB7DFC569A4C7554F8659640A1.pdf; Supplier: LCSC; Convert to PCB: yes
U12 = ICM-20602: BOM_Manufacturer: TDK InvenSense; Contributor: LCSC; SMT Type: Extend; BOM_Supplier: LCSC; BOM_Supplier Part: C97633; BOM_Manufacturer Part: ICM-20602; BOM_LCSC Assembly: Yes; spicePre: U; spiceSymbolName: ICM-20602
U13 = HMC5883L: Add into BOM: yes; Symbol: HMC5883L; Device: HMC5883L; LCSC Part Name: HMC5883L; Supplier Part: C2859540; Manufacturer Part: HMC5883L; Supplier Footprint: LPCC-16_L3.0-W3.0-P0.50; JLCPCB Part Class: 扩展库; Datasheet: 2021-07-28/72509S/c1235ff140a5464880e3b48633b24d5e/HMC5883L中文.pdf; Supplier: LCSC; Convert to PCB: yes; Name: HMC5883L
U? = ICM-42688-P: Manufacturer: TDK InvenSense(应美盛); Add into BOM: yes; Name: ICM-42688-P; Symbol: ICM-42688-P; Device: ICM-42688-P; LCSC Part Name: ICM 42688 P; Supplier Part: C1850418; Manufacturer Part: ICM-42688-P; Supplier Footprint: LGA-14(2.5x3); JLCPCB Part Class: Extended Part; Datasheet: https://atta.szlcsc.com/upload/public/pdf/source/20210703/CF24204867ACE5B754A2B035F23E5931.pdf; Supplier: LCSC; Convert to PCB: yes

## Nets that join several sheets
GND: 主控及低压电源 (111 pins), 传感器,通信模块电路 (26 pins)
VCC_3V3_IC: 主控及低压电源 (27 pins), 传感器,通信模块电路 (22 pins)
IN__ICM20602_CS: 主控及低压电源 (U1.2), 传感器,通信模块电路 (U12.5)
IN_BMI088_CSB1_ACC: 主控及低压电源 (U1.33), 传感器,通信模块电路 (U10.14)
IN_BMI088_CSB2_GYRO: 主控及低压电源 (U1.35), 传感器,通信模块电路 (U10.5)
IN_BMI088_INT1_EXIT7_ACC: 主控及低压电源 (U1.38), 传感器,通信模块电路 (U10.16)
IN_BMI088_INT2_EXIT1_GYRO: 主控及低压电源 (U1.36), 传感器,通信模块电路 (U10.12)
IN_ICM20602_INT_EXIT8: 主控及低压电源 (U1.39), 传感器,通信模块电路 (U12.6)
SENSOR_I2C2_SCL: 主控及低压电源 (M1.41 U1.47), 传感器,通信模块电路 (5 pins)
SENSOR_I2C2_SDA: 主控及低压电源 (M1.39 U1.48), 传感器,通信模块电路 (5 pins)
SENSOR_SPI1_MISO: 主控及低压电源 (M1.26 U1.90), 传感器,通信模块电路 (U10.10 U10.15 U12.4)
SENSOR_SPI1_MOSI: 主控及低压电源 (M1.67 U1.32), 传感器,通信模块电路 (U10.9 U12.3)
SENSOR_SPI1_SCK: 主控及低压电源 (M1.71 U1.30), 传感器,通信模块电路 (U10.8 U12.2)